# EAGLE schematic e (EAGLE 7.1.0)
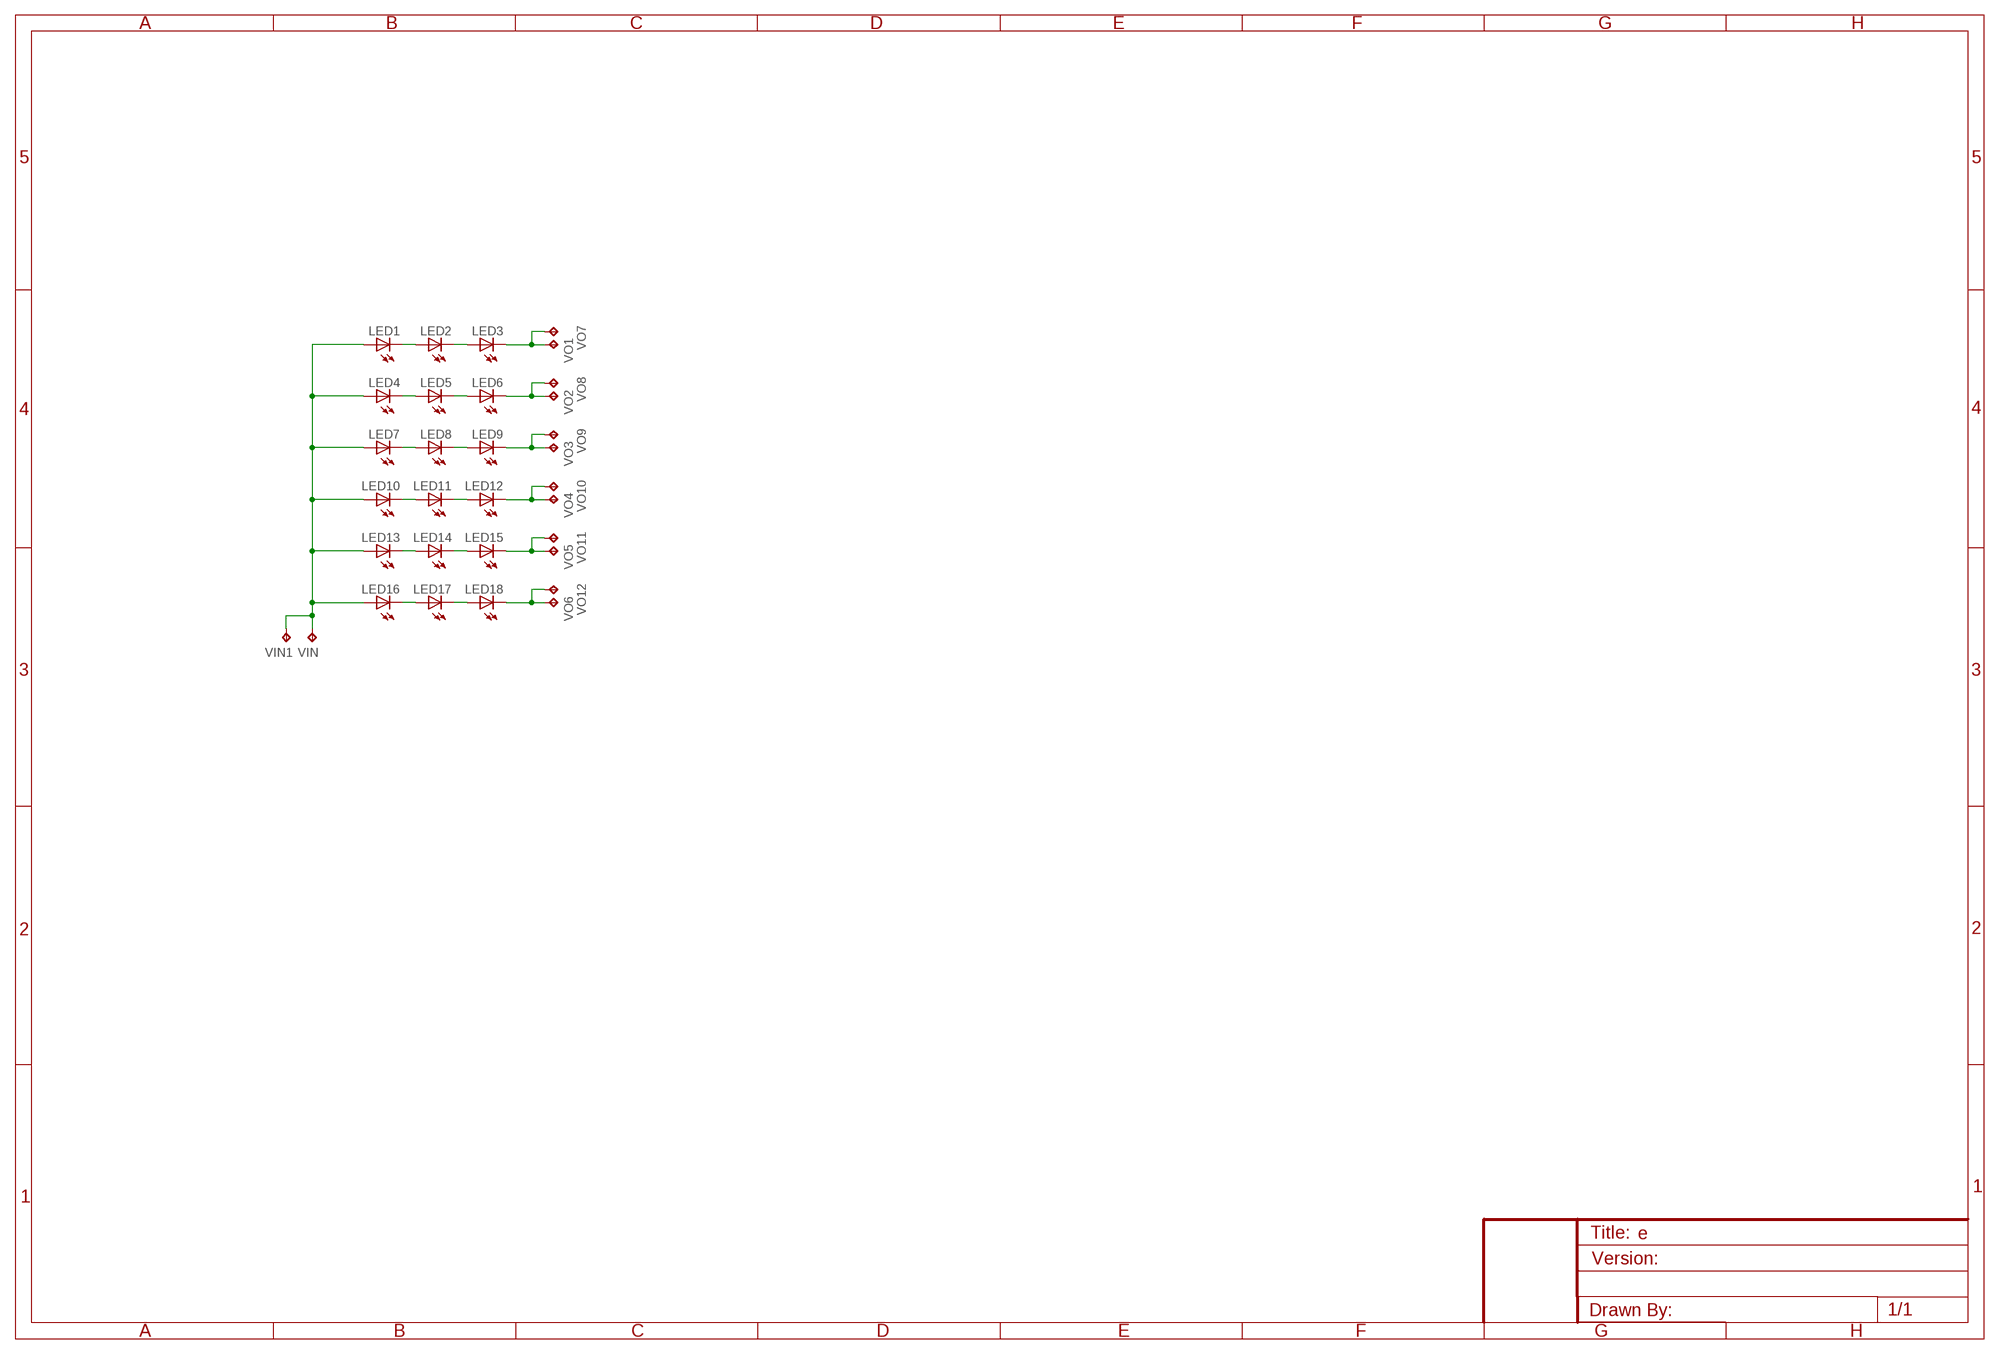
[diagram p0: schematic, sheet 1]

## Parts
LED1  LED0805  [LED_0805]
LED2  LED0805  [LED_0805]
LED3  LED0805  [LED_0805]
LED4  LED0805  [LED_0805]
LED5  LED0805  [LED_0805]
LED6  LED0805  [LED_0805]
LED7  LED0805  [LED_0805]
LED8  LED0805  [LED_0805]
LED9  LED0805  [LED_0805]
LED10  LED0805  [LED_0805]
LED11  LED0805  [LED_0805]
LED12  LED0805  [LED_0805]
LED13  LED0805  [LED_0805]
LED14  LED0805  [LED_0805]
LED15  LED0805  [LED_0805]
LED16  LED0805  [LED_0805]
LED17  LED0805  [LED_0805]
LED18  LED0805  [LED_0805]
VIN  TEST_POINTPAD1-20  [P1-20]
VIN1  TEST_POINTPAD1-20  [P1-20]
VO1  TEST_POINTPAD1-20  [P1-20]
VO2  TEST_POINTPAD1-20  [P1-20]
VO3  TEST_POINTPAD1-20  [P1-20]
VO4  TEST_POINTPAD1-20  [P1-20]
VO5  TEST_POINTPAD1-20  [P1-20]
VO6  TEST_POINTPAD1-20  [P1-20]
VO7  TEST_POINTPAD1-20  [P1-20]
VO8  TEST_POINTPAD1-20  [P1-20]
VO9  TEST_POINTPAD1-20  [P1-20]
VO10  TEST_POINTPAD1-20  [P1-20]
VO11  TEST_POINTPAD1-20  [P1-20]
VO12  TEST_POINTPAD1-20  [P1-20]

## Nets
N$39: LED2.C LED3.A
N$40: LED1.C LED2.A
N$41: LED5.C LED6.A
N$42: LED4.C LED5.A
N$43: LED8.C LED9.A
N$44: LED7.C LED8.A
N$45: LED11.C LED12.A
N$46: LED10.C LED11.A
N$47: LED14.C LED15.A
N$48: LED13.C LED14.A
N$49: LED17.C LED18.A
N$50: LED16.C LED17.A
VIN: LED1.A LED4.A LED7.A LED10.A LED13.A LED16.A VIN1.TP VIN.TP
VOUT1: LED3.C VO1.TP VO7.TP
VOUT2: LED6.C VO2.TP VO8.TP
VOUT3: LED9.C VO3.TP VO9.TP
VOUT4: LED12.C VO4.TP VO10.TP
VOUT5: LED15.C VO5.TP VO11.TP
VOUT6: LED18.C VO6.TP VO12.TP

## Library data of the parts
LED1-LED18 = CyberRailGuru:LED: LEDs Standard schematic elements and footprints for 5mm, 3mm, 1206, and 0603 sized LEDs. 5mm - Spark Fun Electronics SKU : COM-00529 (and others)
VIN VIN1 VO1-VO12 = CyberRailGuru:TEST_POINT: Test pad